# Altium schematic sheet llrf_fmc_ext_female.SchDoc: =GlobalProjectName
size 410 x 297 mm; SheetNumber: 2; SheetTotal: 3; PageSetup: Record=PageOptions|CenterHorizontal=True|CenterVertical=True|PrintScale=1.00|XCorrection=1.00|YCorrection=1.00|PrintKind=1|BorderSize=5000000|LeftOffset=0|BottomOffset=0|Orientation=2|PaperLength=1000|PaperWidth=1000|Scale=100|PaperSource=15|PrintQuality=1200|MediaType=1|DitherType=10|PaperKind=A3|PrintScaleMode=1; Weight: -; ScaleFactor: -
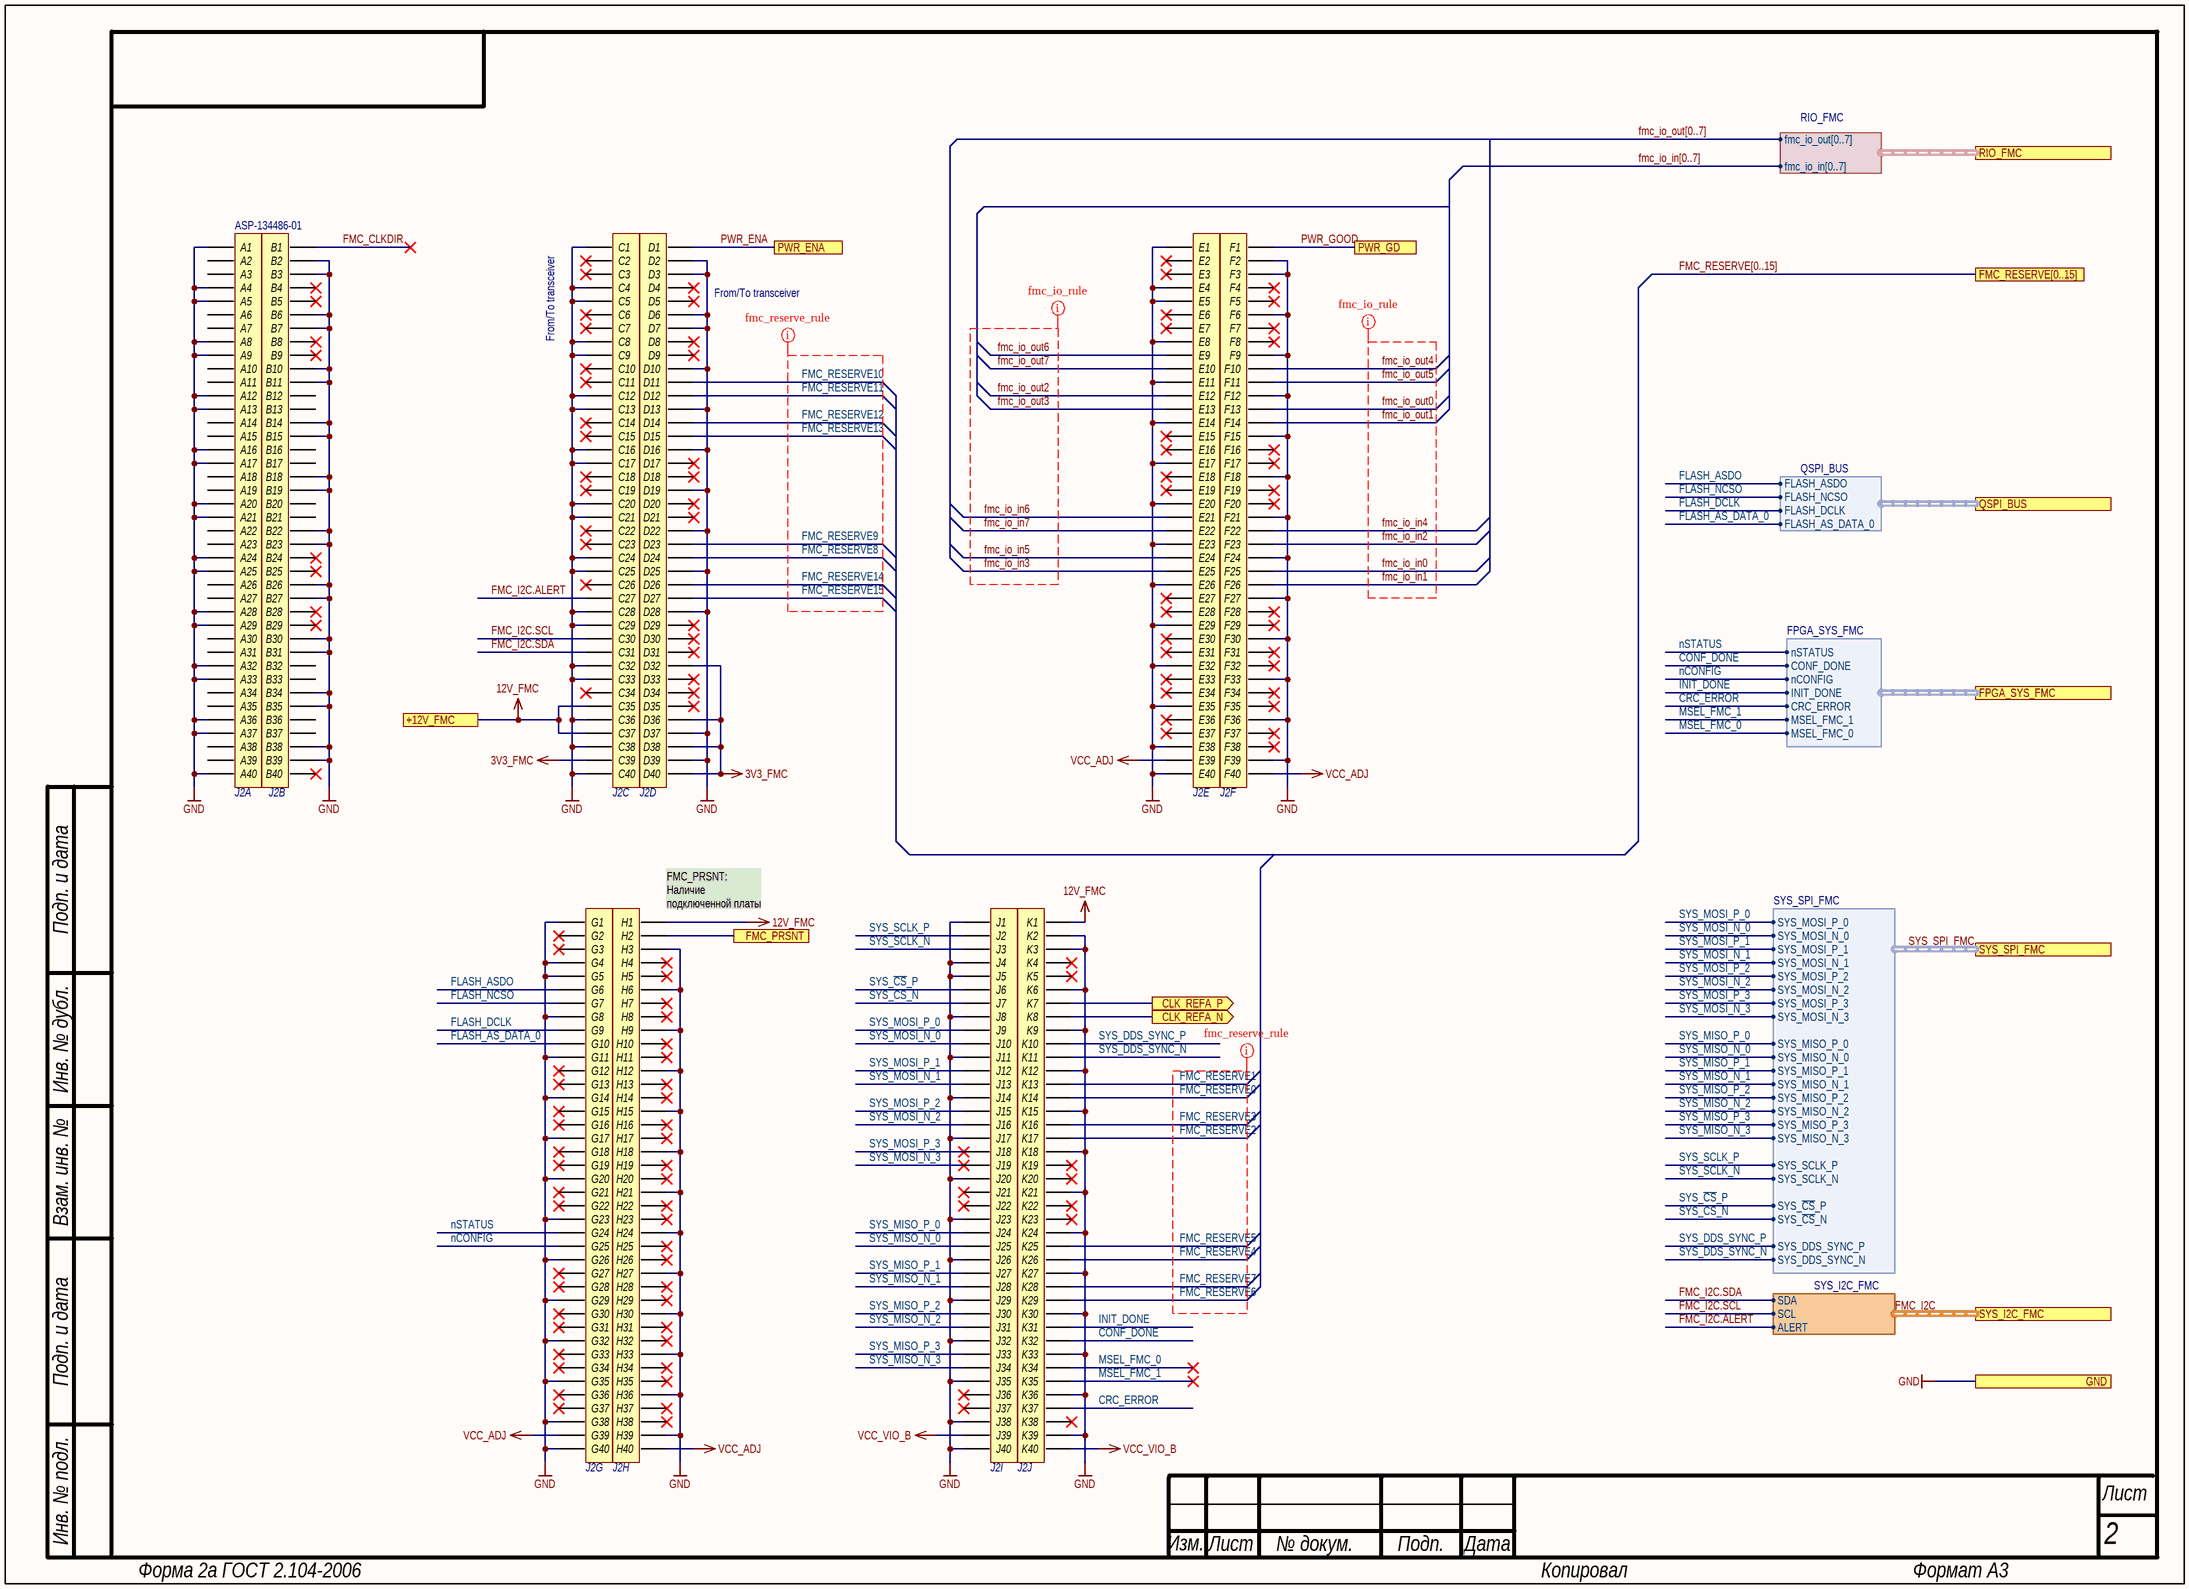
[diagram p0: llrf_fmc_ext_female.SchDoc]

## Parts
J2  ASP-134486-01  [ASP-134486-01]  (parts A,B,C,D,E,F,G,H,I,J of 10)

## Ports
+12V_FMC, CLK_REFA_N (out), CLK_REFA_P (out), FMC_PRSNT, FMC_RESERVE[0..15], FPGA_SYS_FMC (harness FPGA_SYS_FMC), GND, PWR_ENA, PWR_GD, QSPI_BUS (harness QSPI_BUS), RIO_FMC (harness RIO_FMC), SYS_I2C_FMC (harness SYS_I2C_FMC), SYS_SPI_FMC (harness SYS_SPI_FMC)

## Harnesses
RIO_FMC: fmc_io_out[0..7], fmc_io_in[0..7]
SYS_I2C_FMC: SDA, SCL, ALERT
SYS_SPI_FMC: SYS_MOSI_P_0, SYS_SCLK_P, SYS_~{CS}_P, SYS_MOSI_P_1, SYS_MOSI_P_2, SYS_MOSI_P_3, SYS_MOSI_N_0, SYS_MOSI_N_1, SYS_MOSI_N_2, SYS_MOSI_N_3, SYS_MISO_P_0, SYS_MISO_P_1, SYS_MISO_P_2, SYS_MISO_P_3, SYS_MISO_N_0, SYS_MISO_N_1, SYS_MISO_N_2, SYS_MISO_N_3, SYS_SCLK_N, SYS_DDS_SYNC_P, SYS_~{CS}_N, SYS_DDS_SYNC_N
QSPI_BUS: FLASH_ASDO, FLASH_NCSO, FLASH_DCLK, FLASH_AS_DATA_0
FPGA_SYS_FMC: INIT_DONE, nSTATUS, CONF_DONE, nCONFIG, MSEL_FMC_0, MSEL_FMC_1, CRC_ERROR

## Nets
3V3_FMC: J2.C39 J2.D32 J2.D36 J2.D38 J2.D40
12V_FMC: J2.C35 J2.C37 J2.H1 J2.K1 ; port +12V_FMC
GND: J2.A1 J2.A4 J2.A5 J2.A8 J2.A9 J2.A12 J2.A13 J2.A16 J2.A17 J2.A20 J2.A21 J2.A24 J2.A25 J2.A28 J2.A29 J2.A32 J2.A33 J2.A36 J2.A37 J2.A40 J2.B2 J2.B3 J2.B6 J2.B7 J2.B10 J2.B11 J2.B14 J2.B15 J2.B18 J2.B19 J2.B22 J2.B23 J2.B26 J2.B27 J2.B30 J2.B31 J2.B34 J2.B35 J2.B38 J2.B39 J2.C1 J2.C4 J2.C5 J2.C8 J2.C9 J2.C12 J2.C13 J2.C16 J2.C17 J2.C20 J2.C21 J2.C24 J2.C25 J2.C28 J2.C29 J2.C32 J2.C33 J2.C36 J2.C38 J2.C40 J2.D2 J2.D3 J2.D6 J2.D7 J2.D10 J2.D13 J2.D16 J2.D19 J2.D22 J2.D25 J2.D28 J2.D37 J2.D39 J2.E1 J2.E4 J2.E5 J2.E8 J2.E11 J2.E14 J2.E17 J2.E20 J2.E23 J2.E26 J2.E29 J2.E32 J2.E35 J2.E38 J2.E40 J2.F2 J2.F3 J2.F6 J2.F9 J2.F12 J2.F15 J2.F18 J2.F21 J2.F24 J2.F27 J2.F30 J2.F33 J2.F36 J2.F39 J2.G1 J2.G4 J2.G5 J2.G8 J2.G11 J2.G14 J2.G17 J2.G20 J2.G23 J2.G26 J2.G29 J2.G32 J2.G35 J2.G38 J2.G40 J2.H3 J2.H6 J2.H9 J2.H12 J2.H15 J2.H18 J2.H21 J2.H24 J2.H27 J2.H30 J2.H33 J2.H36 J2.H39 J2.J1 J2.J4 J2.J5 J2.J8 J2.J11 J2.J14 J2.J17 J2.J20 J2.J23 J2.J26 J2.J29 J2.J32 J2.J35 J2.J38 J2.J40 J2.K2 J2.K3 J2.K6 J2.K9 J2.K12 J2.K15 J2.K18 J2.K21 J2.K24 J2.K27 J2.K30 J2.K33 J2.K36 J2.K39 ; port GND
VCC_ADJ: J2.E39 J2.F40 J2.G39 J2.H40
VCC_VIO_B: J2.J39 J2.K40
CLK_REFA_N: J2.K8 ; port CLK_REFA_N
CLK_REFA_P: J2.K7 ; port CLK_REFA_P
CONF_DONE: J2.K32 ; port FPGA_SYS_FMC.CONF_DONE
CRC_ERROR: J2.K37 ; port FPGA_SYS_FMC.CRC_ERROR
FLASH_AS_DATA_0: J2.G10 ; port QSPI_BUS.FLASH_AS_DATA_0
FLASH_ASDO: J2.G6 ; port QSPI_BUS.FLASH_ASDO
FLASH_DCLK: J2.G9 ; port QSPI_BUS.FLASH_DCLK
FLASH_NCSO: J2.G7 ; port QSPI_BUS.FLASH_NCSO
FMC_CLKDIR: J2.B1
FMC_I2C.ALERT: J2.C27 ; port SYS_I2C_FMC.ALERT
FMC_I2C.SCL: J2.C30 ; port SYS_I2C_FMC.SCL
FMC_I2C.SDA: J2.C31 ; port SYS_I2C_FMC.SDA
fmc_io_in0: J2.F25
fmc_io_in1: J2.F26
fmc_io_in2: J2.F23
fmc_io_in3: J2.E25
fmc_io_in4: J2.F22
fmc_io_in5: J2.E24
fmc_io_in6: J2.E21
fmc_io_in7: J2.E22
fmc_io_out0: J2.F13
fmc_io_out1: J2.F14
fmc_io_out2: J2.E12
fmc_io_out3: J2.E13
fmc_io_out4: J2.F10
fmc_io_out5: J2.F11
fmc_io_out6: J2.E9
fmc_io_out7: J2.E10
FMC_PRSNT: J2.H2 ; port FMC_PRSNT
FMC_RESERVE0: J2.K14
FMC_RESERVE1: J2.K13
FMC_RESERVE2: J2.K17
FMC_RESERVE3: J2.K16
FMC_RESERVE4: J2.K26
FMC_RESERVE5: J2.K25
FMC_RESERVE6: J2.K29
FMC_RESERVE7: J2.K28
FMC_RESERVE8: J2.D24
FMC_RESERVE9: J2.D23
FMC_RESERVE10: J2.D11
FMC_RESERVE11: J2.D12
FMC_RESERVE12: J2.D14
FMC_RESERVE13: J2.D15
FMC_RESERVE14: J2.D26
FMC_RESERVE15: J2.D27
INIT_DONE: J2.K31 ; port FPGA_SYS_FMC.INIT_DONE
MSEL_FMC_0: J2.K34 ; port FPGA_SYS_FMC.MSEL_FMC_0
MSEL_FMC_1: J2.K35 ; port FPGA_SYS_FMC.MSEL_FMC_1
nCONFIG: J2.G25 ; port FPGA_SYS_FMC.nCONFIG
nSTATUS: J2.G24 ; port FPGA_SYS_FMC.nSTATUS
PWR_ENA: J2.D1 ; port PWR_ENA
PWR_GOOD: J2.F1 ; port PWR_GD
SYS_~{CS}_N: J2.J7 ; port SYS_SPI_FMC.SYS_~{CS}_N
SYS_~{CS}_P: J2.J6 ; port SYS_SPI_FMC.SYS_~{CS}_P
SYS_DDS_SYNC_N: J2.K11 ; port SYS_SPI_FMC.SYS_DDS_SYNC_N
SYS_DDS_SYNC_P: J2.K10 ; port SYS_SPI_FMC.SYS_DDS_SYNC_P
SYS_MISO_N_0: J2.J25 ; port SYS_SPI_FMC.SYS_MISO_N_0
SYS_MISO_N_1: J2.J28 ; port SYS_SPI_FMC.SYS_MISO_N_1
SYS_MISO_N_2: J2.J31 ; port SYS_SPI_FMC.SYS_MISO_N_2
SYS_MISO_N_3: J2.J34 ; port SYS_SPI_FMC.SYS_MISO_N_3
SYS_MISO_P_0: J2.J24 ; port SYS_SPI_FMC.SYS_MISO_P_0
SYS_MISO_P_1: J2.J27 ; port SYS_SPI_FMC.SYS_MISO_P_1
SYS_MISO_P_2: J2.J30 ; port SYS_SPI_FMC.SYS_MISO_P_2
SYS_MISO_P_3: J2.J33 ; port SYS_SPI_FMC.SYS_MISO_P_3
SYS_MOSI_N_0: J2.J10 ; port SYS_SPI_FMC.SYS_MOSI_N_0
SYS_MOSI_N_1: J2.J13 ; port SYS_SPI_FMC.SYS_MOSI_N_1
SYS_MOSI_N_2: J2.J16 ; port SYS_SPI_FMC.SYS_MOSI_N_2
SYS_MOSI_N_3: J2.J19 ; port SYS_SPI_FMC.SYS_MOSI_N_3
SYS_MOSI_P_0: J2.J9 ; port SYS_SPI_FMC.SYS_MOSI_P_0
SYS_MOSI_P_1: J2.J12 ; port SYS_SPI_FMC.SYS_MOSI_P_1
SYS_MOSI_P_2: J2.J15 ; port SYS_SPI_FMC.SYS_MOSI_P_2
SYS_MOSI_P_3: J2.J18 ; port SYS_SPI_FMC.SYS_MOSI_P_3
SYS_SCLK_N: J2.J3 ; port SYS_SPI_FMC.SYS_SCLK_N
SYS_SCLK_P: J2.J2 ; port SYS_SPI_FMC.SYS_SCLK_P

Not connected (* = marked no-connect by the designer): J2 A2 A3 A6 A7 A10 A11 A14 A15 A18 A19 A22 A23 A26 A27 A30 A31 A34 A35 A38 A39 B4* B5* B8* B9* B12 B13 B16 B17 B20 B21 B24* B25* B28* B29* B32 B33 B36 B37 B40* C2* C3* C6* C7* C10* C11* C14* C15* C18* C19* C22* C23* C26* C34* D4* D5* D8* D9* D17* D18* D20* D21* D29* D30* D31* D33* D34* D35* E2* E3* E6* E7* E15* E16* E18* E19* E27* E28* E30* E31* E33* E34* E36* E37* F4* F5* F7* F8* F16* F17* F19* F20* F28* F29* F31* F32* F34* F35* F37* F38* G2* G3* G12* G13* G15* G16* G18* G19* G21* G22* G27* G28* G30* G31* G33* G34* G36* G37* H4* H5* H7* H8* H10* H11* H13* H14* H16* H17* H19* H20* H22* H23* H25* H26* H28* H29* H31* H32* H34* H35* H37* H38* J21* J22* J36* J37* K4* K5* K19* K20* K22* K23* K38*

## Buses and harness runs
bus fmc_io_in[0..7]
bus fmc_io_out[0..7]
bus FMC_RESERVE[0..15] = port FMC_RESERVE[0..15]
harness FMC_I2C = port SYS_I2C_FMC
harness SYS_SPI_FMC = port SYS_SPI_FMC

## Layout directives
rule Matched Net Lengths [Tolerance = 1mm]: fmc_io_in0, fmc_io_in1, fmc_io_in2, fmc_io_in3, fmc_io_in4, fmc_io_in5, fmc_io_in6, fmc_io_in7, fmc_io_out0, fmc_io_out1, fmc_io_out2, fmc_io_out3, fmc_io_out4, fmc_io_out5, fmc_io_out6, fmc_io_out7, FMC_RESERVE0, FMC_RESERVE1, FMC_RESERVE2, FMC_RESERVE3, FMC_RESERVE4, FMC_RESERVE5, FMC_RESERVE6, FMC_RESERVE7, FMC_RESERVE8, FMC_RESERVE9, FMC_RESERVE10, FMC_RESERVE11, FMC_RESERVE12, FMC_RESERVE13, FMC_RESERVE14, FMC_RESERVE15

## Notes on the sheet
- (near J2) From/To transceiver
- (near J2) FMC_PRSNT:
  Наличие подключенной платы
- Подп. и дата
- Инв. № дубл.
- Взам. инв. №
- Инв. № подл.
- Изм.
- Лист
- № докум.
- Подп.
- Дата
- Форма 2а ГОСТ 2.104-2006
- Копировал
- Формат А3

## Library data of the parts
J2 = ASP-134486-01: FMC, HPC, Terminal Array Assembly, Surface Mount, 0.050" Pitch, 400 Pins; MANUFACTURER: SAMTEC; PCB DECAL: SEAM-40-XX.X-XX-10-X-A; Потребление, Вт: 0,0; Назначение: FMC HPC. Terminal Array Assembly, Surface Mount, 0.050" Pitch, 400 Pins; CREATED: March 24, 2015 - Wendy Xin; ComponentLink1Description: DataSheet; ComponentLink1URL: https://suddendocs.samtec.com/prints/asp-134486-01-mkt.pdf; Supplier 1: Digi-Key; Supplier Part Number 1: SAM8728CT-ND; Наименование: ASP-134486-01; Описание: ASP-134486-01